# EAGLE design Power-Monitor-Module (EAGLE 9.6.2)
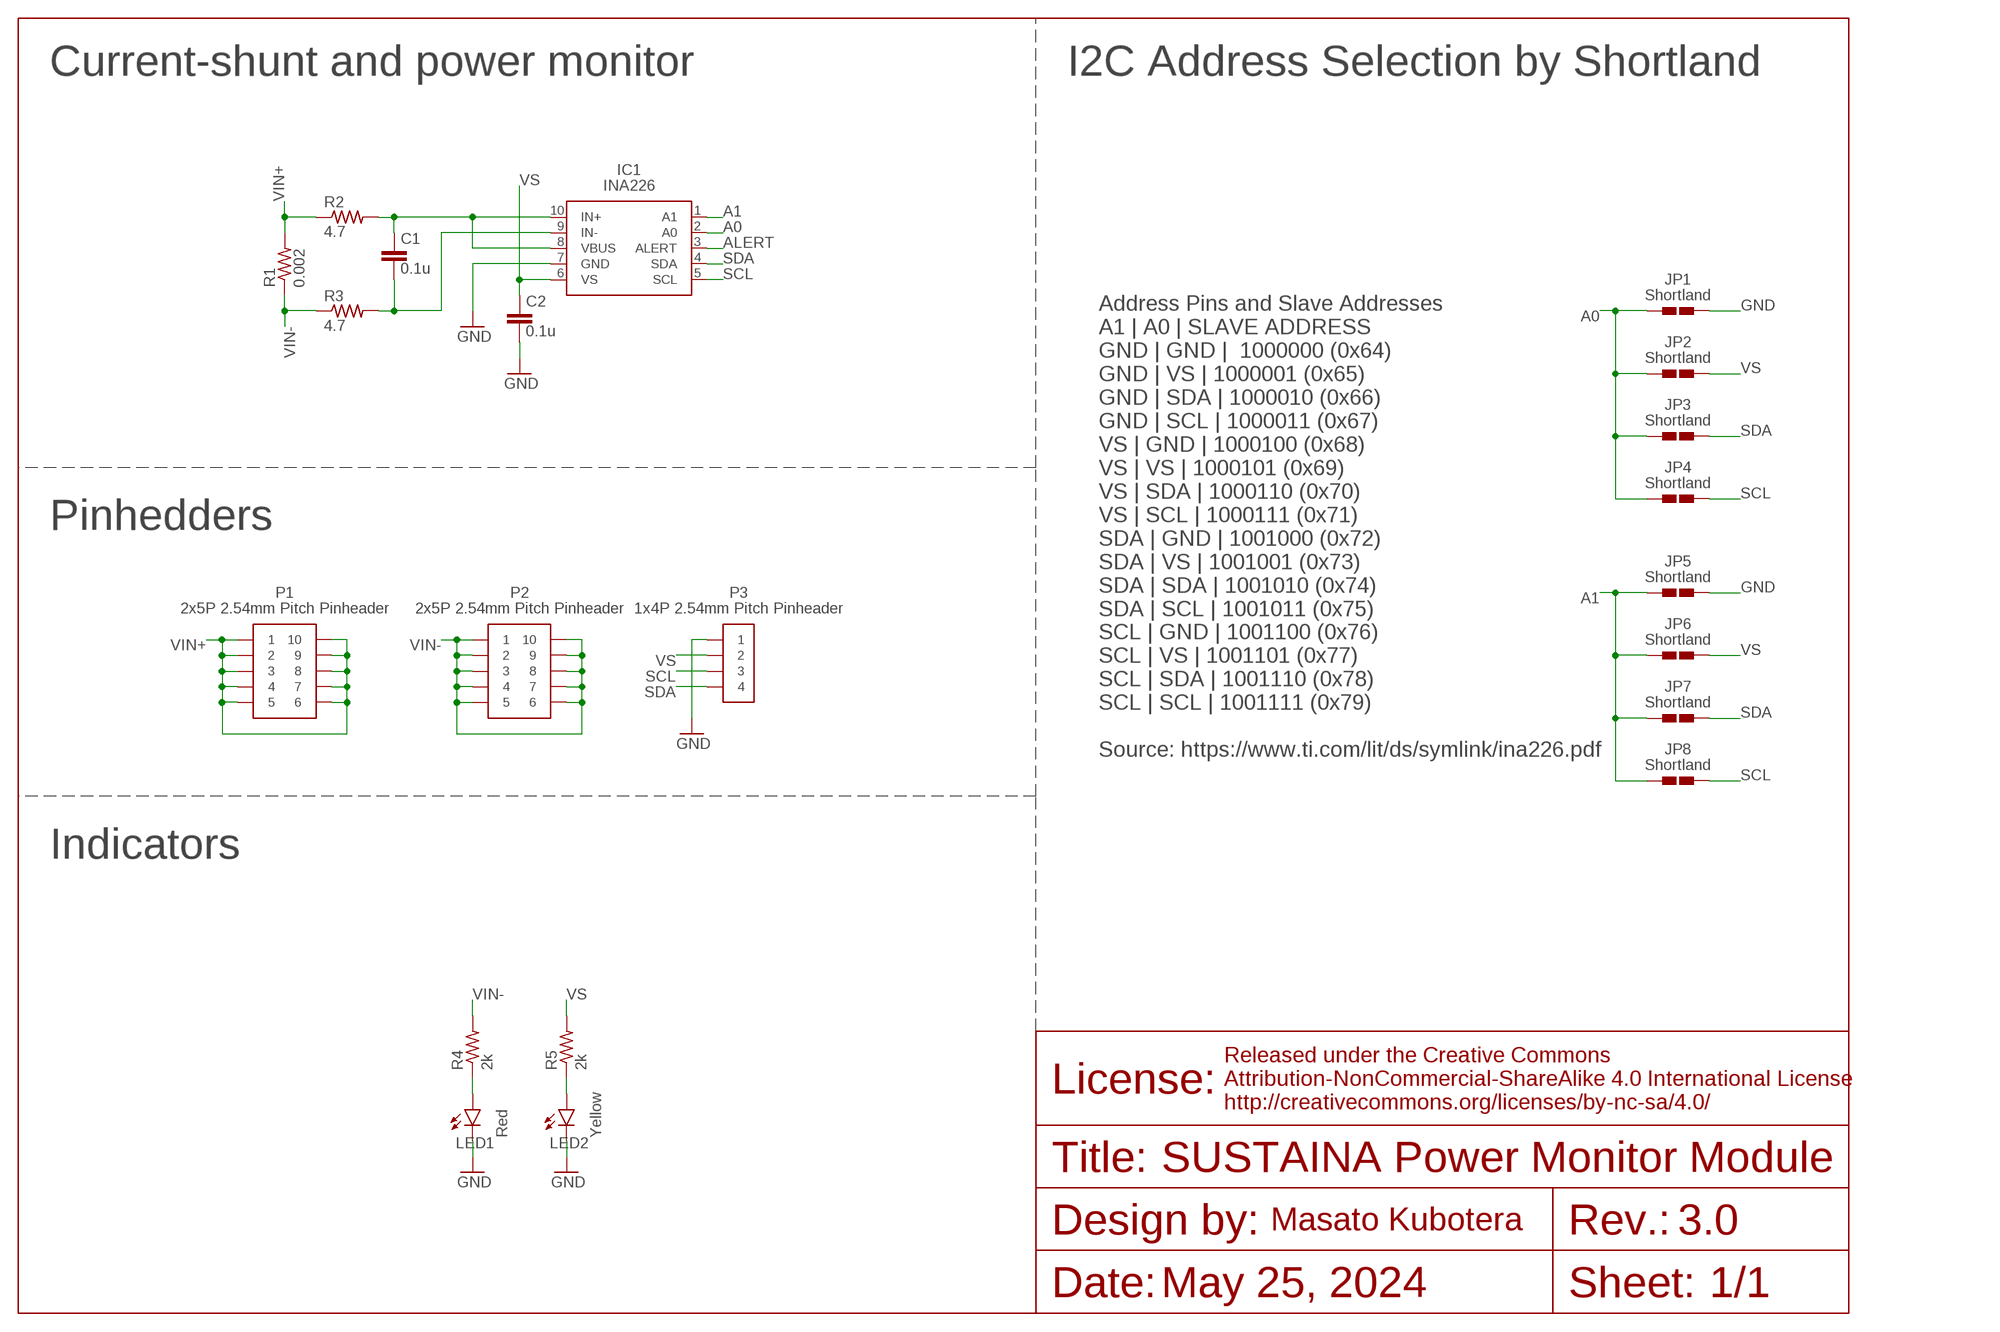
[diagram p0: schematic, sheet 1]

## Parts
C1  0.1u  C-EUC0402  [C0402]
C2  0.1u  C-EUC0402  [C0402]
IC1  INA226  [MSOP-10]
JP1  SHORTLAND  [SHORTLAND]
JP2  SHORTLAND  [SHORTLAND]
JP3  SHORTLAND  [SHORTLAND]
JP4  SHORTLAND  [SHORTLAND]
JP5  SHORTLAND  [SHORTLAND]
JP6  SHORTLAND  [SHORTLAND]
JP7  SHORTLAND  [SHORTLAND]
JP8  SHORTLAND  [SHORTLAND]
LED1  Red  LEDSML0603  [SML0603]
LED2  Yellow  LEDSML0603  [SML0603]
P1  2X5P  [2X5P]
P2  2X5P  [2X5P]
P3  1X4P  [1X4P]
R1  0.002  R-US_R2512  [R2512]
R2  4.7  R-US_R0402  [R0402]
R3  4.7  R-US_R0402  [R0402]
R4  2k  R-US_R0402  [R0402]
R5  2k  R-US_R0402  [R0402]

## Nets
A0 [data]: IC1.2(A0) JP1.1 JP2.1 JP3.1 JP4.1
A1 [data]: IC1.1(A1) JP5.1 JP6.1 JP7.1 JP8.1
ALERT [data]: IC1.3(ALERT)
GND [power]: C2.2 IC1.7(GND) JP1.2 JP5.2 LED1.C LED2.C P3.1
IN+ [power]: C1.1 IC1.8(VBUS) IC1.10(IN+) R2.2
IN- [power]: C1.2 IC1.9(IN-) R3.2
LED1_: LED1.A R4.1
LED2: LED2.A R5.1
SCL [data]: IC1.5(SCL) JP4.2 JP8.2 P3.3
SDA [data]: IC1.4(SDA) JP3.2 JP7.2 P3.4
VIN+: P1.1 P1.2 P1.3 P1.4 P1.5 P1.6 P1.7 P1.8 P1.9 P1.10 R1.2 R2.1
VIN-: P2.1 P2.2 P2.3 P2.4 P2.5 P2.6 P2.7 P2.8 P2.9 P2.10 R1.1 R3.1 R4.2
VS [power]: C2.1 IC1.6(VS) JP2.2 JP6.2 P3.2 R5.2

## Notes on the sheet
- Current-shunt and power monitor | I2C Address Selection by Shortland
- Address Pins and Slave Addresses
  A1 | A0 | SLAVE ADDRESS
  GND | GND |  1000000 (0x64)
  GND | VS | 1000001 (0x65)
  GND | SDA | 1000010 (0x66)
  GND | SCL | 1000011 (0x67)
  VS | GND | 1000100 (0x68)
  VS | VS | 1000101 (0x69)
  VS | SDA | 1000110 (0x70)
  VS | SCL | 1000111 (0x71)
  SDA | GND | 1001000 (0x72)
  SDA | VS | 1001001 (0x73)
  SDA | SDA | 1001010 (0x74)
  SDA | SCL | 1001011 (0x75)
  SCL | GND | 1001100 (0x76)
  SCL | VS | 1001101 (0x77)
  SCL | SDA | 1001110 (0x78)
  SCL | SCL | 1001111 (0x79)
  
  Source: https://www.ti.com/lit/ds/symlink/ina226.pdf
- Pinhedders
- Indicators
- SUSTAINA Power Monitor Module
- 3.0
- May 25, 2024 | 1/1

## Library data of the parts
C1 C2 = rcl:C-EU: CAPACITOR, European symbol; SPICEPREFIX: C
IC1 = INA226:INA226
JP1-JP8 = Shortland:SHORTLAND
LED1 LED2 = led:LED: LED OSRAM: - CHIPLED LG R971, LG N971, LY N971, LG Q971, LY Q971, LO R971, LY R971 LH N974, LH R974 LS Q976, LO Q976, LY Q976 LO Q996 - Hyper CHIPLED LW Q18S LB Q993, LB Q99A, LB R99A - SideLED LS A670, LO A670, LY A670, LG A670, LP A670 LB A673, LV A673, LT A673, LW A673 LH A674 LY A675 LS A676, LA A676, LO A676, LY A676, LW A676 LS A679, LY A679, LG A679 - Hyper Micro SIDELED® LS Y876, LA Y876, LO Y876, LY Y876 LT Y87S - SmartLED LW L88C, LW L88S LB L89C, LB L89S, LG L890 LS L89K, LO L89K, LY L89K LS L896, LA L896, LO L896, LY L896 - TOPLED LS T670, LO T670, LY T670, LG T670, LP T670 LSG T670, LSP T670, LSY T670, LOP T670, LYG T670 LG T671, LOG T671, LSG T671 LB T673, LV T673, LT T673, LW T673 LH T674 LS T676, LA T676, LO T676, LY T676, LB T676, LH T676, LSB T676, LW T676 LB T67C, LV T67C, LT T67C, LS T67K, LO T67K, LY T67K, LW E67C LS E67B, LA E67B, LO E67B, LY E67B, LB E67C, LV E67C, LT E67C LW T67C LS T679, LY T679, LG T679 LS T770, LO T770, LY T770, LG T770, LP T770 LB T773, LV T773, LT T773, LW T773 LH T774 LS E675, LA E675, LY E675, LS T675 LS T776, LA T776, LO T776, LY T776, LB T776 LHGB T686 LT T68C, LB T68C - Hyper Mini TOPLED® LB M676 - Mini TOPLED Santana® LG M470 LS M47K, LO M47K, LY M47K Source: http://www.osram.convergy.de LUXEON: - LUMILED® LXK2-PW12-R00, LXK2-PW12-S00, LXK2-PW14-U00, LXK2-PW14-V00 LXK2-PM12-R00, LXK2-PM12-S00, LXK2-PM14-U00 LXK2-PE12-Q00, LXK2-PE12-R00, LXK2-PE12-S00, LXK2-PE14-T00, LXK2-PE14-U00 LXK2-PB12-K00, LXK2-PB12-L00, LXK2-PB12-M00, LXK2-PB14-N00, LXK2-PB14-P00, LXK2-PB14-Q00 LXK2-PR12-L00, LXK2-PR12-M00, LXK2-PR14-Q00, LXK2-PR14-R00 LXK2-PD12-Q00, LXK2-PD12-R00, LXK2-PD12-S00 LXK2-PH12-R00, LXK2-PH12-S00 LXK2-PL12-P00, LXK2-PL12-Q00, LXK2-PL12-R00 Source: www.luxeon.com KINGBRIGHT: KA-3528ASYC Source: www.kingbright.com
P1 P2 = Pinheader:2X5P
P3 = Pinheader:1X4P
R1-R5 = rcl:R-US_: RESISTOR, American symbol; SPICEPREFIX: R

## Net classes
1 data: width 0.152 mm
2 power: width 0.203 mm
6 low_power: width 0.203 mm, clearance 0.127 mm

## Board
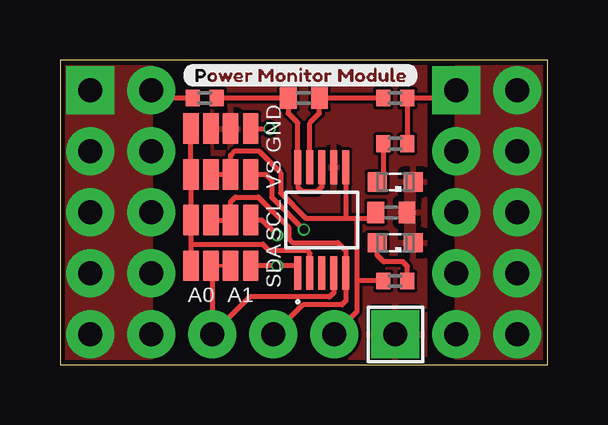
[diagram p1: board, top side]
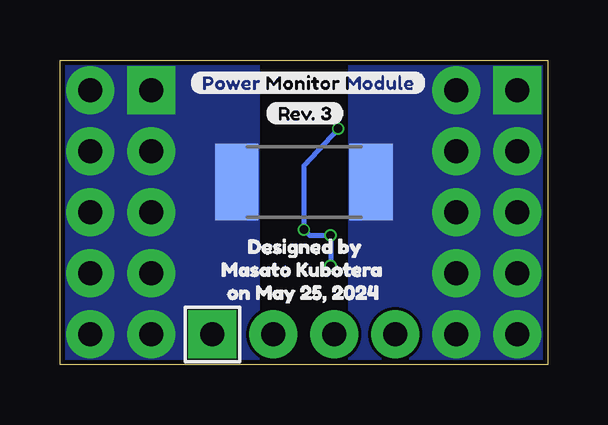
[diagram p2: board, bottom side, seen from below]

Size 20.32 x 12.7 mm. Coordinates in mm from the lower left corner, seen from the top.
Outline: 0,0 20.32,0 20.32,12.7 0,12.7 0,0
Copper layers (1*16): Top 0.035mm / dielectric 1.6mm / Bottom 0.035mm
Design rules "jlcpcb-2layers *": minimum track width 5mil, minimum drill 0.3mm, track to track 5mil, track to pad 5mil, pad to pad 5mil, via to via 5mil, smd to smd 5mil, copper to edge 0.2mm, drill to drill 6mil, minimum pad ring 10mil, minimum via ring 3mil, stop-mask expansion 0mil, vias tented up to drill 15mil, thermal gap 10mil

### Footprints (pad centres in the part's own frame; a part is rotated, then mirrored left to right if it is on the bottom)
C0402 = smd 0.7 x 0.9: 1 -0.65,0; 2 0.65,0
MSOP-10 = smd 1.4 x 0.3: 1 -2.2,1; 2 -2.2,0.5; 3 -2.2,0; 4 -2.2,-0.5; 5 -2.2,-1; 6 2.2,-1; 7 2.2,-0.5; 8 2.2,0; 9 2.2,0.5; 10 2.2,1
SHORTLAND = smd 0.635 x 1.27: 1 -0.419,0; 2 0.419,0
SML0603 = smd 0.8 x 0.8: A 0.75,0; C -0.75,0
2X5P = drill 1 pad 2 square: 1 -1.27,5.08 | drill 1 pad 2: 2 -1.27,2.54; 3 -1.27,0; 4 -1.27,-2.54; 5 -1.27,-5.08; 6 1.27,-5.08; 7 1.27,-2.54; 8 1.27,0; 9 1.27,2.54; 10 1.27,5.08
1X4P = drill 1 pad 2 square: 1 0,3.81 | drill 1 pad 2: 2 0,1.27; 3 0,-1.27; 4 0,-3.81
R2512 = smd 1.8 x 3.2: 1 -2.8,0; 2 2.8,0
R0402 = smd 0.6 x 0.7: 1 -0.5,0; 2 0.5,0

### Placement (x,y rotation side)
C1  10.16,11.11 0 top
C2  13.81,6.35 0 top
IC1  10.91,6.03 90 top
JP1  5.87,9.84 0 top
JP2  5.87,7.94 0 top
JP3  5.87,4.13 0 top
JP4  5.87,6.03 0 top
JP5  7.52,9.84 180 top
JP6  7.52,7.94 180 top
JP7  7.52,4.13 180 top
JP8  7.52,6.03 180 top
LED1  13.97,7.62 180 top
LED2  13.97,5.08 180 top
P1  2.54,6.35 0 top
P2  17.78,6.35 0 top
P3  10.16,1.27 270 top
R1  10.16,7.62 0 bottom
R2  6.03,11.11 0 top
R3  13.97,11.11 180 top
R4  13.97,9.21 0 top
R5  13.97,3.49 180 top
U$1  [POWER_MONITOR_MODULE]  5.08,12.06 0 top
U$2  [POWER_MONITOR_MODULE]  14.92,11.75 0 bottom
U$3  [REV#_3]  11.75,10.48 0 bottom
U$5  [DESIGNED_BY_MASATO_KUBOTERA_ON_MAY_25-0.0225]  10.16,3.97 0 bottom

### Tracks (layer width: path | path; a pad name or v marks a point on that pad's centre or on a via)
A0
  Top 0.203: 5.46,5.08 JP4.1 JP2.1 JP1.1 | 5.46,5.08 JP3.1 | 5.46,5.08 5.5,5.03 8.45,5.03 8.72,4.76 10.29,4.76 10.41,4.64 IC1.2
A1  (via drill 0.35)
  Top 0.203: JP7.1 v9.05,4.13 9.91,4.13 IC1.1 | v9.05,5.4 8.41,6.03 JP8.1 | JP6.1 8.58,7.94 8.82,7.7 8.82,6.97 v10.16,5.64 | JP5.1 v8.73,9.84
  Bottom 0.203: v9.05,4.13 v9.05,5.4 9.92,5.4 v10.16,5.64 10.16,8.3 v8.73,9.84
GND
  pour Top: 6.35,15.24 6.35,-2.54 15.24,-2.54 15.24,15.24
IN+
  Top 0.203: R2.2 C1.1 9.51,10.48 9.91,10.08 IC1.10 9.91,7.39 10.08,7.22 10.72,7.22 10.91,7.42 IC1.8
IN-
  Top 0.203: IC1.9 10.41,10.08 10.81,10.48 C1.2 R3.2
LED1_
  Top 0.203: LED1.A 13.23,7.66 13.47,7.91 R4.1
LED2
  Top 0.203: R5.1 14.47,4.1 14.29,4.29 13.49,4.29 13.22,4.56 LED2.A
SCL
  Top 0.203: JP4.2 JP8.2 7.11,6.79 7.3,6.98 8.27,6.98 9.53,5.72 9.53,5.25 9.68,5.09 11.58,5.09 11.91,4.76 IC1.5 11.91,2.66 11.75,2.5 10.12,2.5 P3.3
SDA
  Top 0.152: JP3.2 JP7.2
  Top 0.203: IC1.4 11.41,3 11.24,2.83 7.91,2.83 P3.4 6.35,4.07 JP3.2
VIN+
  Top 0.203: R2.1 4.13,11.11 P1.10
  pour Bottom (no thermals): -1.27,13.97 -1.27,-1.27 8.26,-1.27 8.26,13.97
  pour Top (no thermals): -2.54,15.24 -2.54,-2.54 3.81,-2.54 3.81,15.24
VIN-
  Top 0.203: P2.1 16.19,11.11 R3.1 R4.2
  pour Bottom (no thermals): 12.06,13.97 12.06,-1.27 21.59,-1.27 21.59,13.97
  pour Top (no thermals): 16.51,15.24 16.51,-2.54 22.86,-2.54 22.86,15.24
VS
  Top 0.203: R5.2 12.38,3.49 | JP2.2 JP6.2 7.11,8.74 7.26,8.89 8.3,8.89 9.19,8 9.19,7.16 10.24,6.11 11.91,6.11 | 12.38,3.49 12.38,6.11 | P3.2 12.38,2.22 12.38,3.49 | 11.91,6.11 12.38,6.11 | 12.38,6.11 12.92,6.11 12.94,6.11 13.16,6.11 C2.1 | IC1.6 11.91,6.12 11.91,6.11

### Text on the board
tPlace: GND | VS | SCL | SDA | A0 | A1